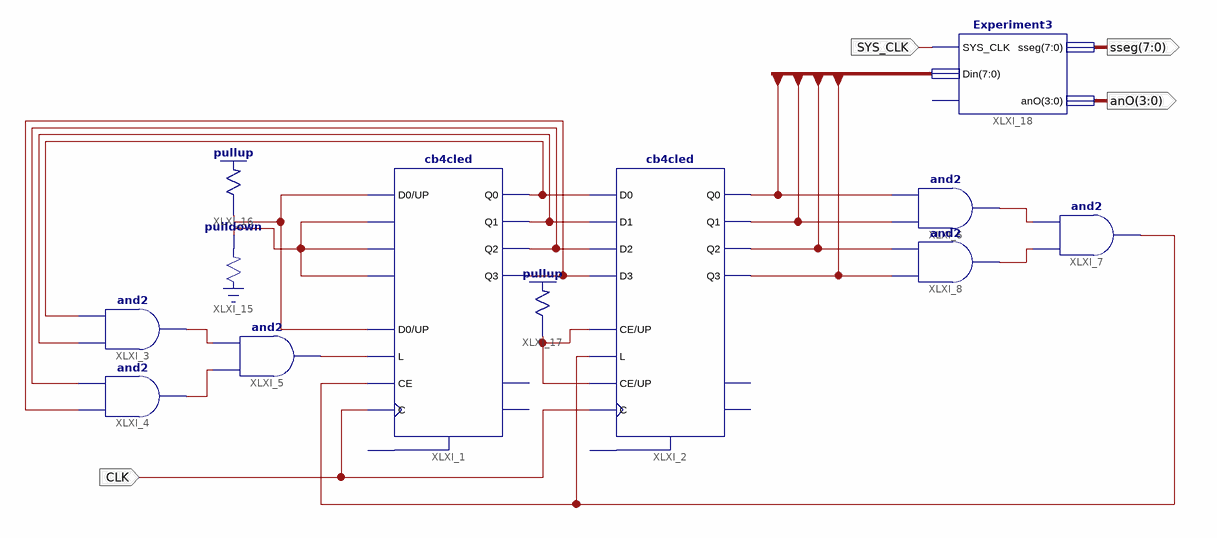
[diagram p0: schematic sheet 1]
// Xilinx ISE schematic Experiment8.sch (spartan3e) as structural Verilog: 12 symbols, 4 ports
module Experiment8 (
  input  SYS_CLK,
  input  CLK,
  output [7:0] sseg,
  output [3:0] anO
);

  wire WIRE, XLXN_1, XLXN_2, XLXN_3, XLXN_4, XLXN_5, XLXN_6, XLXN_9, XLXN_16, XLXN_37, XLXN_39, XLXN_43,
       XLXN_57;
  wire [7:0] Din;

  cb4cled XLXI_1 (
    .C(CLK), .CE(WIRE), .D0(XLXN_37), .D1(XLXN_39), .D2(XLXN_39), .D3(XLXN_39), .L(XLXN_57), .UP(XLXN_37),
    .Q0(XLXN_1), .Q1(XLXN_2), .Q2(XLXN_3), .Q3(XLXN_4));  // open: CLR, CEO, TC
  cb4cled XLXI_2 (
    .C(CLK), .CE(XLXN_43), .D0(XLXN_1), .D1(XLXN_2), .D2(XLXN_3), .D3(XLXN_4), .L(WIRE), .UP(XLXN_43),
    .Q0(Din[0]), .Q1(Din[1]), .Q2(Din[2]), .Q3(Din[3]));  // open: CLR, CEO, TC
  and XLXI_3 (XLXN_16, XLXN_2, XLXN_1);
  and XLXI_4 (XLXN_9, XLXN_4, XLXN_3);
  and XLXI_5 (XLXN_57, XLXN_9, XLXN_16);
  and XLXI_7 (WIRE, XLXN_5, XLXN_6);
  and XLXI_6 (XLXN_6, Din[1], Din[0]);
  and XLXI_8 (XLXN_5, Din[3], Din[2]);
  \pulldown  XLXI_15 (.O(XLXN_39));
  \pullup  XLXI_16 (.O(XLXN_37));
  \pullup  XLXI_17 (.O(XLXN_43));
  Experiment3 XLXI_18 (.SYS_CLK(SYS_CLK), .Din(Din), .sseg(sseg), .anO(anO));  // open: En
endmodule
